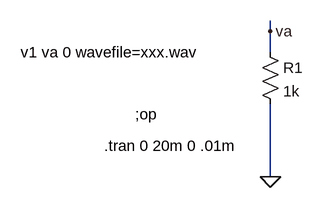
[diagram p0: schematic Draft2.asc]
Draft2.asc, the LTspice schematic file:
Version 4
SHEET 1 880 680
WIRE 352 48 352 32
WIRE 352 80 352 48
WIRE 352 272 352 160
FLAG 352 272 0
FLAG 352 48 va
SYMBOL res 336 64 R0
SYMATTR InstName R1
SYMATTR Value 1k
TEXT 144 176 Left 2 !;op
TEXT -32 80 Left 2 !v1 va 0 wavefile=xxx.wav
TEXT 96 224 Left 2 !.tran 0 20m 0 .01m

The netlist it stands for:
* Draft2.asc
R1 va 0 1k
;op
v1 va 0 wavefile=xxx.wav
.tran 0 20m 0 .01m
.backanno
.end